# EAGLE design Serial DB9 v10 ok (EAGLE 6.2)
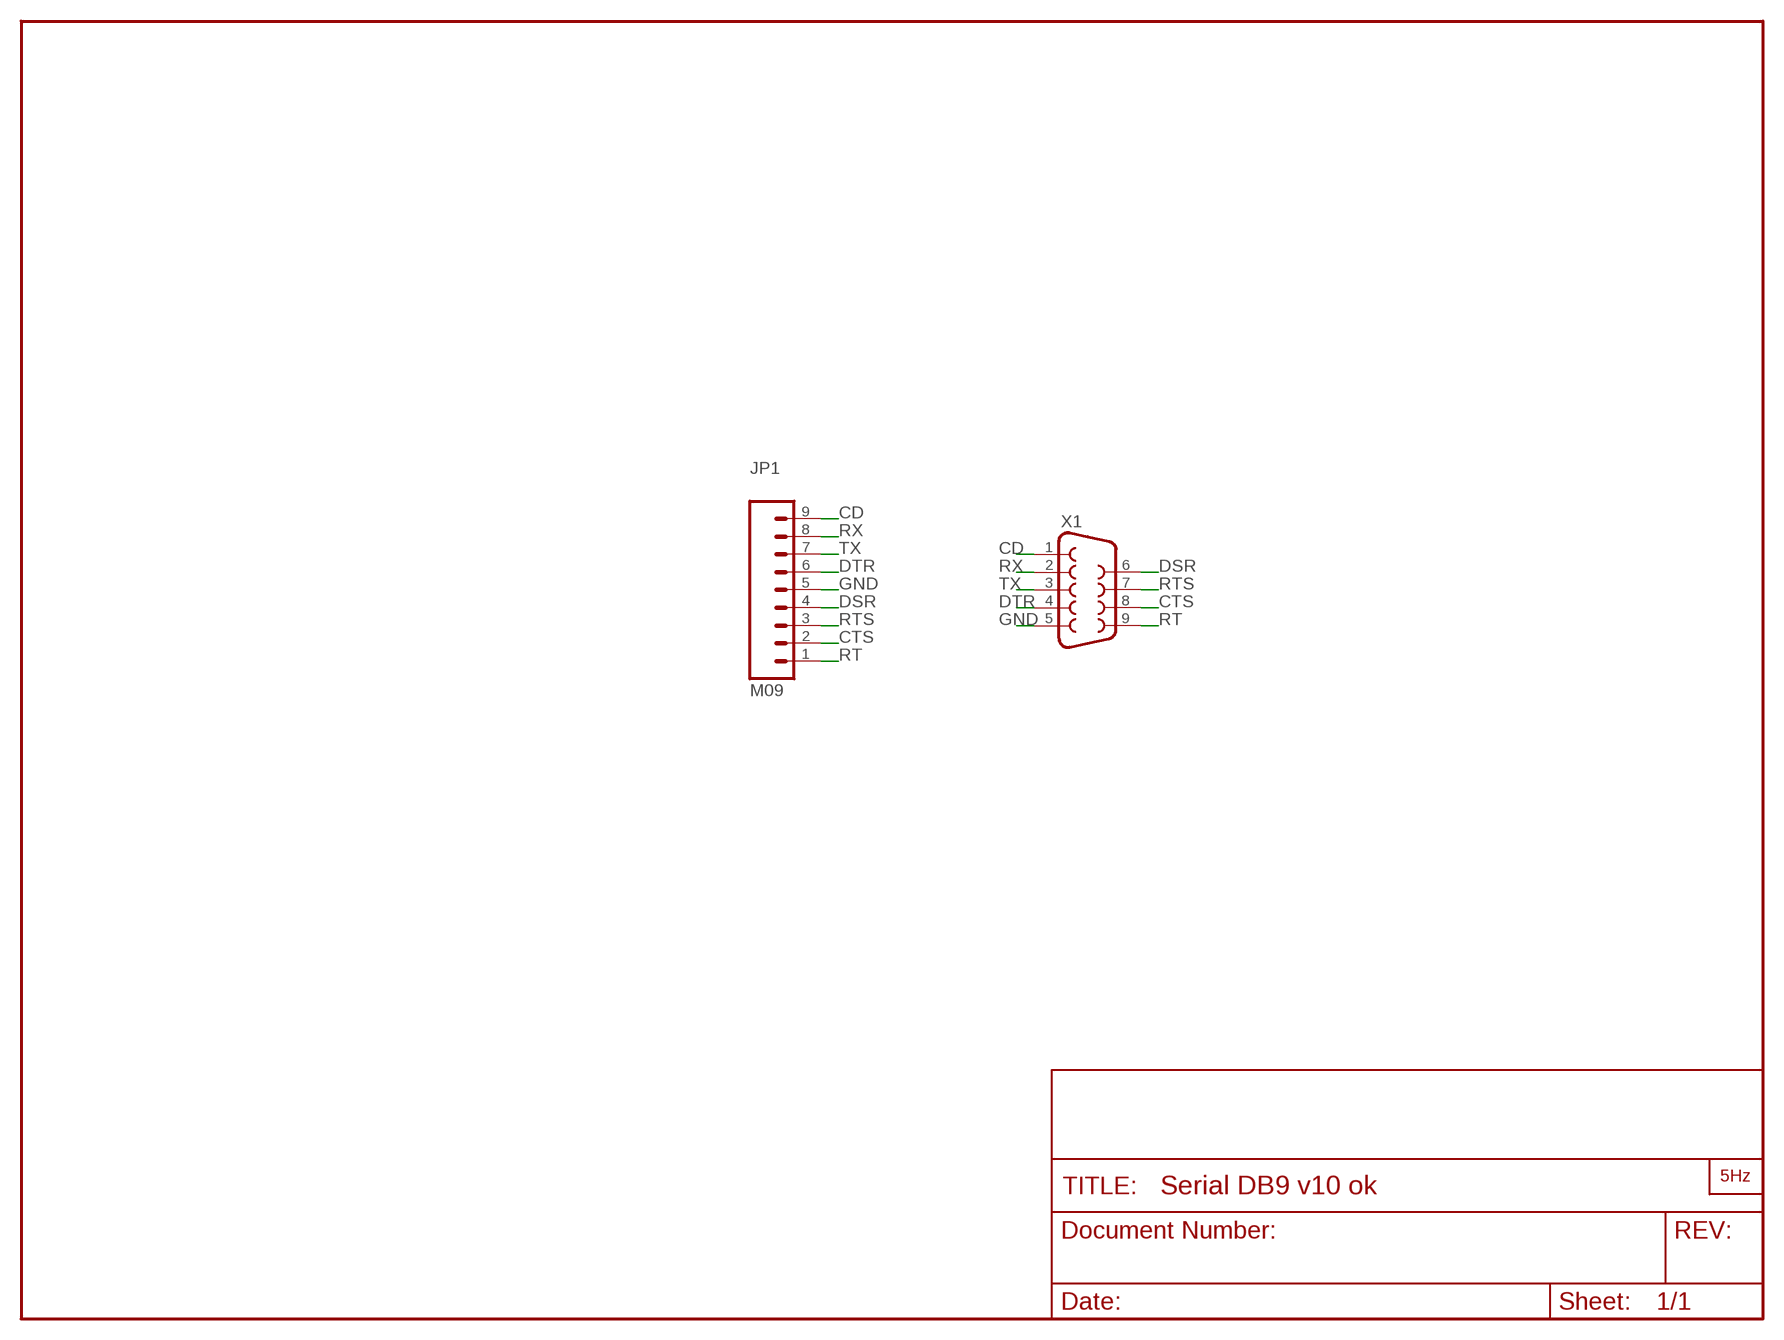
[diagram p0: schematic, sheet 1]

## Parts
JP1  M09  [1X09]
U$1  LOGO2_SILK10MM  [LOGO2_10MM]
X1  DB9FEMALE  [DB9]

## Nets
CD: JP1.9 X1.1
CTS: JP1.2 X1.8
DSR: JP1.4 X1.6
DTR: JP1.6 X1.4
GND: JP1.5 X1.5
RT: JP1.1 X1.9
RTS: JP1.3 X1.7
RX: JP1.8 X1.2
TX: JP1.7 X1.3

## Library data of the parts
JP1 = SparkFun:M09: Header 9 Standard 9-pin 0.1" header. Use with straight break away headers (SKU : PRT-00116), right angle break away headers (PRT-00553), swiss pins (PRT-00743), machine pins (PRT-00117), and female headers (PRT-00115).
U$1 = LOGO:LOGO2_SILK: PRINCIPAL
X1 = SparkFun:DB9: DB9 Connector Standard DB9 (D-Sub 9) serial connector. Can be used for CAN bus as well as RS485 and RS232. Footprint production proven. Spark Fun Electronics SKU : PRT-00429

## Board
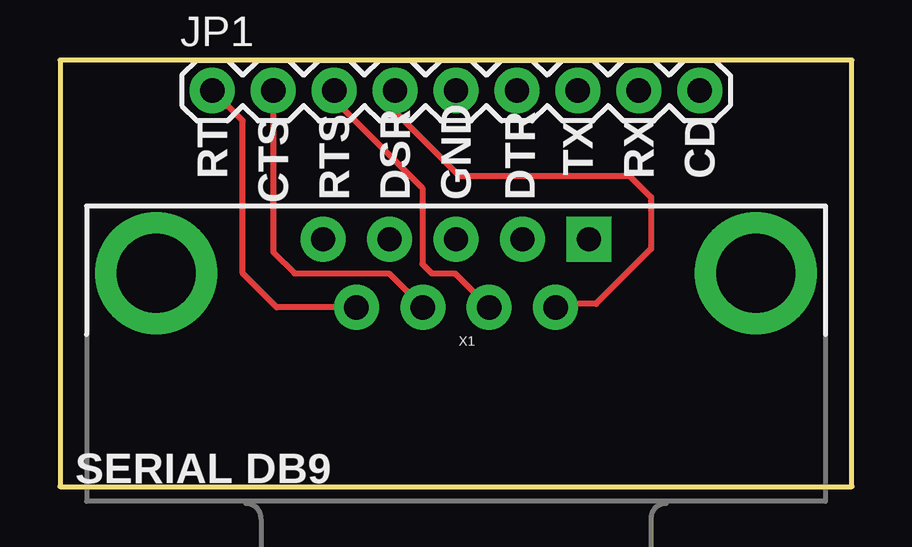
[diagram p1: board, top side]
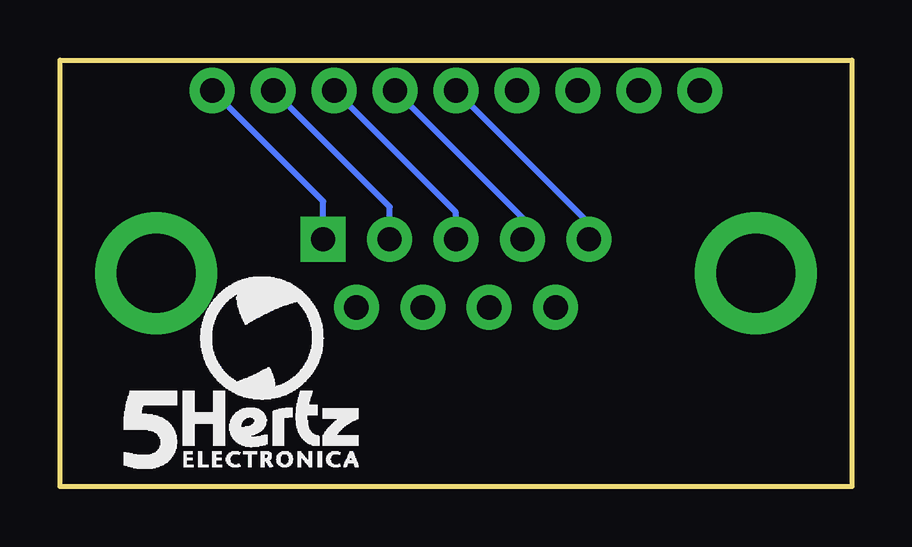
[diagram p2: board, bottom side, seen from below]

Size 33.02 x 17.78 mm. Coordinates in mm from the lower left corner, seen from the top.
Outline: 0,0 33.02,0 33.02,17.78 0,17.78 0,0
Copper layers (1*16): Top 0.035mm / dielectric 1.5mm / Bottom 0.035mm
Design rules: minimum track width 8mil, minimum drill 20mil, track to track 8mil, track to pad 8mil, pad to pad 8mil, via to via 8mil, smd to smd 8mil, copper to edge 10mil, drill to drill 8mil, minimum pad ring 12mil, minimum via ring 10mil, stop-mask expansion 4mil, vias tented up to drill 25mil, thermal gap 10mil

### Footprints (pad centres in the part's own frame; a part is rotated, then mirrored left to right if it is on the bottom)
1X09 = drill 1.016 pad 1.88: 1 0,0; 2 2.54,0; 3 5.08,0; 4 7.62,0; 5 10.16,0; 6 12.7,0; 7 15.24,0; 8 17.78,0; 9 20.32,0
DB9 = drill 1.016 pad 1.88 square: 1 -5.54,-1.42 | drill 1.016 pad 1.88: 2 -2.77,-1.42; 3 0,-1.42; 4 2.77,-1.42; 5 5.54,-1.42; 6 -4.15,1.42; 7 -1.38,1.42; 8 1.38,1.42; 9 4.15,1.42 | drill 3.302 pad 5.08: G1 -12.5,0; G2 12.5,0

### Placement (x,y rotation side)
JP1  6.35,16.51 0 top
U$1  30.35,0.76 0 bottom
X1  16.51,8.89 180 top

### Tracks (layer width: path | path; a pad name or v marks a point on that pad's centre or on a via)
CD
  Bottom 0.254: X1.1 22.05,11.89 JP1.9
CTS
  Top 0.254: JP1.2 8.89,9.78 9.78,8.89 13.71,8.89 X1.8
DSR
  Top 0.254: JP1.4 13.97,15.62 16.64,12.95 23.75,12.95 24.64,12.06 24.64,9.91 22.35,7.62 20.81,7.62 X1.6
DTR
  Bottom 0.254: X1.4 13.74,11.2 JP1.6
GND
  Bottom 0.254: X1.5 10.97,10.97 JP1.5
RT
  Top 0.254: X1.9 9.04,7.47 7.62,8.89 7.62,15.24 JP1.1
RTS
  Top 0.254: JP1.3 11.43,16.13 15.11,12.45 15.11,9.27 15.49,8.89 16.47,8.89 X1.7
RX
  Bottom 0.254: X1.2 19.28,11.66 JP1.8
TX
  Bottom 0.254: X1.3 16.51,11.43 JP1.7

### Text on the board
tPlace: RT | TX | RX | CD | CTS | RTS | DSR | GND | DTR | SERIAL DB9